# Altium schematic sheet USB Programmer.SchDoc
size A4; Organization: Machine Intellgence Laboratory; Des1: This is the MCU responsible; Des2: for programming the main MCU; Des3: from USB over UART.; SheetNumber: 2; SheetTotal: 5; Author1: Russell MacGregor; VersionControl_Repository: BatteryMonitorSpring2025
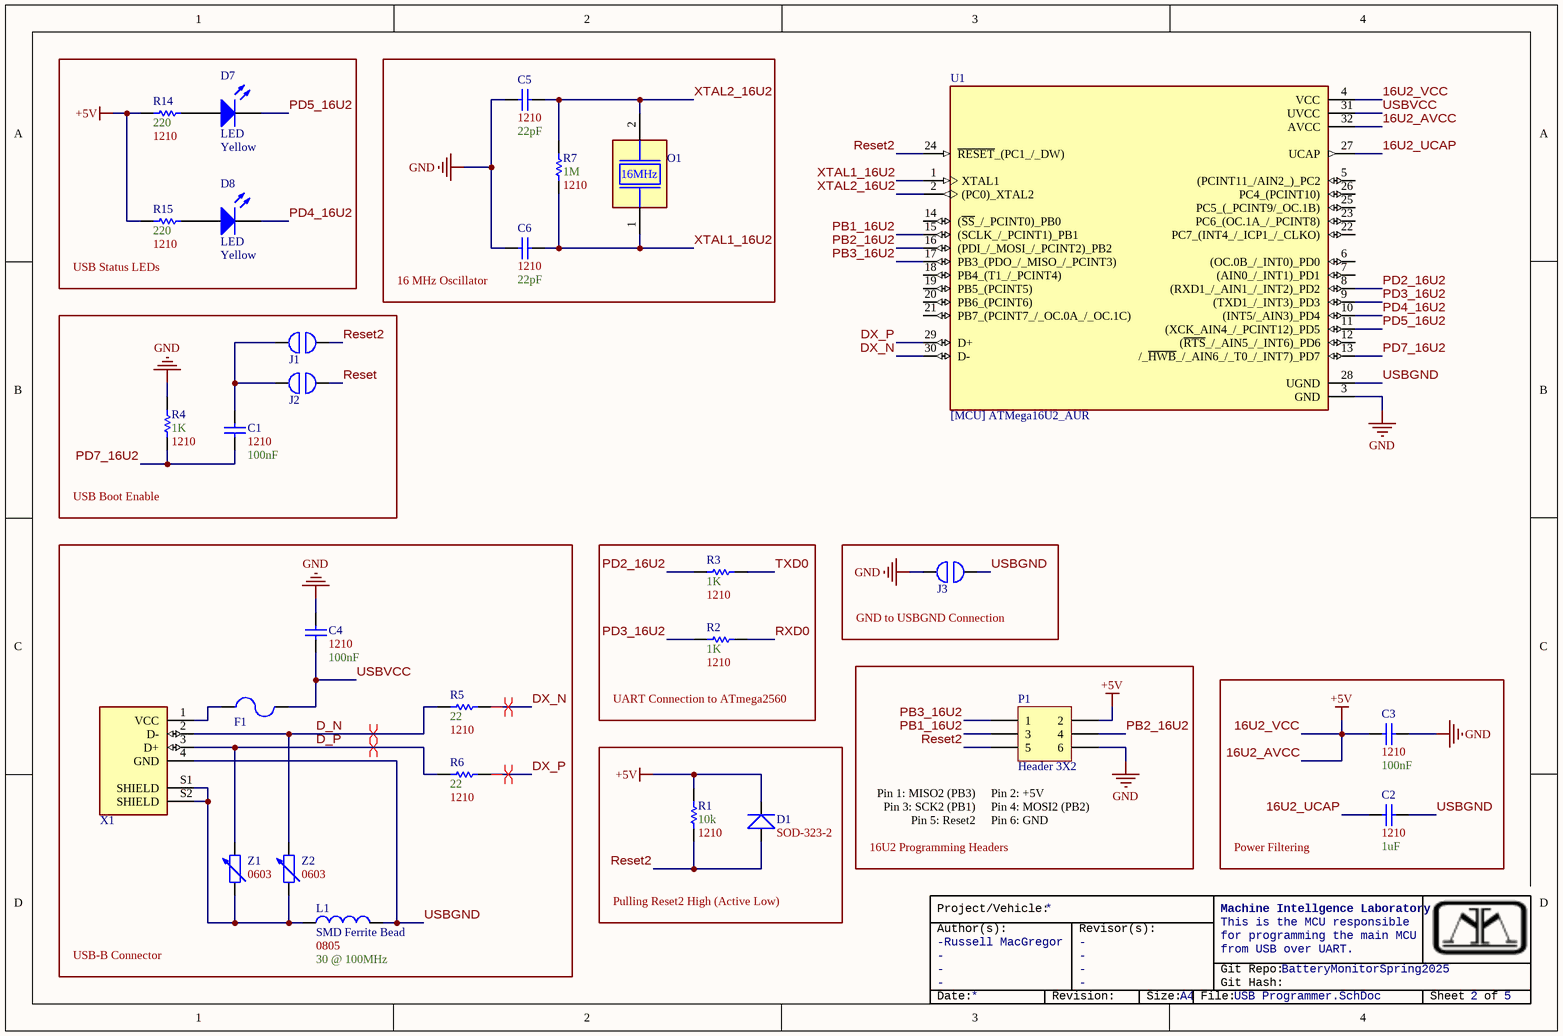
[diagram p0: USB Programmer.SchDoc]

## Parts
C1  Size Package: 1210  Capacitance: 100nF  [SMD Capacitor [1210]]  (hidden comment: SMD Cap - Nonpolarized)
C2  Size Package: 1210  Capacitance: 1uF  [SMD Capacitor [1210]]  (hidden comment: SMD Cap - Nonpolarized)
C3  Size Package: 1210  Capacitance: 100nF  [SMD Capacitor [1210]]  (hidden comment: SMD Cap - Nonpolarized)
C4  Size Package: 1210  Capacitance: 100nF  [SMD Capacitor [1210]]  (hidden comment: SMD Cap - Nonpolarized)
C5  Size Package: 1210  Capacitance: 22pF  [SMD Capacitor [1210]]  (hidden comment: SMD Cap - Nonpolarized)
C6  Size Package: 1210  Capacitance: 22pF  [SMD Capacitor [1210]]  (hidden comment: SMD Cap - Nonpolarized)
D1  Size Package: SOD-323-2  [SMD Diode [SOD-323-2]]  (hidden comment: SMD Diode)
D7  LED  Color: Yellow  [Small Yellow LED]
D8  LED  Color: Yellow  [Small Yellow LED]
F1  SMD 500mA Resetable Fuse  [SMD 500mA Resetable Fuse]  (value not drawn)
J1  Solderable Jumper  [Solderable Jumper]  (value not drawn)
J2  Solderable Jumper  [Solderable Jumper]  (value not drawn)
J3  Solderable Jumper  [Solderable Jumper]  (value not drawn)
L1  SMD Ferrite Bead  Size Package: 0805  Res @ Freq: 30 @ 100MHz  [SMD Ferrite Bead [0805]]
O1  Thru-Hole 16MHz Oscillator  [Thru-Hole 16MHz Oscillator]  (value not drawn)
P1  Header 3X2  [HDR2X3]
R1  Resistance: 10k  Size Package: 1210  [SMD Resistor [1210]]  (hidden comment: SMD Resistor)
R2  Resistance: 1K  Size Package: 1210  [SMD Resistor [1210]]  (hidden comment: SMD Resistor)
R3  Resistance: 1K  Size Package: 1210  [SMD Resistor [1210]]  (hidden comment: SMD Resistor)
R4  Resistance: 1K  Size Package: 1210  [SMD Resistor [1210]]  (hidden comment: SMD Resistor)
R5  Resistance: 22  Size Package: 1210  [SMD Resistor [1210]]  (hidden comment: SMD Resistor)
R6  Resistance: 22  Size Package: 1210  [SMD Resistor [1210]]  (hidden comment: SMD Resistor)
R7  Resistance: 1M  Size Package: 1210  [SMD Resistor [1210]]  (hidden comment: SMD Resistor)
R14  Resistance: 220  Size Package: 1210  [SMD Resistor [1210]]  (hidden comment: SMD Resistor)
R15  Resistance: 220  Size Package: 1210  [SMD Resistor [1210]]  (hidden comment: SMD Resistor)
U1  [MCU] ATMega16U2_AUR  [SMD ATMega16U2_AUR]
X1  USB Type-B Female (Thru-Hole)  [USB Type-B Female (Thru-Hole)]  (value not drawn)
Z1  Size Package: 0603  [SMD Varistor [0603]]  (hidden comment: SMD Varistor)
Z2  Size Package: 0603  [SMD Varistor [0603]]  (hidden comment: SMD Varistor)

## Blocks framed on the sheet
USB Status LEDs: D7 D8 R14 R15
16 MHz Oscillator: C5 C6 O1 R7
USB Boot Enable: C1 J1 J2 R4
USB-B Connector: C4 F1 L1 R5 R6 X1 Z1 Z2
UART Connection to ATmega2560: R2 R3
GND to USBGND Connection: J3
Power Filtering: C2 C3
Pulling Reset2 High (Active Low): D1 R1

## Nets
16U2_AVCC: C3.2 D1.C P1.2 R1.2 R14.2 R15.2 U1.4(VCC) U1.32(AVCC)  [also labelled +5V, 16U2_VCC]
GND: C3.1 C4.2 C5.2 C6.2 J3.1 P1.6 R4.2 U1.3(GND)
16U2_UCAP: C2.2 U1.27(UCAP)
D_N: R5.1 X1.2(D-) Z2.2
D_P: R6.1 X1.3(D+) Z1.2
DX_N: R5.2 U1.30(D-)
DX_P: R6.2 U1.29(D+)
PB1_16U2: P1.3 U1.15((SCLK_/_PCINT1)_PB1)
PB2_16U2: P1.4 U1.16((PDI_/_MOSI_/_PCINT2)_PB2)
PB3_16U2: P1.1 U1.17(PB3_(PDO_/_MISO_/_PCINT3))
PD2_16U2: R3.2 U1.8((RXD1_/_AIN1_/_INT2)_PD2)
PD3_16U2: R2.2 U1.9((TXD1_/_INT3)_PD3)
PD4_16U2: D8.2(K) U1.10((INT5/_AIN3)_PD4)
PD5_16U2: D7.2(K) U1.11((XCK_AIN4_/_PCINT12)_PD5)
PD7_16U2: C1.1 R4.1 U1.13(/_~{HWB}_/_AIN6_/_T0_/_INT7)_PD7)
Reset: J2.2
Reset2: D1.A J1.2 P1.5 R1.1 U1.24(~{RESET}_(PC1_/_DW))
RXD0: R2.1
TXD0: R3.1
USBGND: C2.1 J3.2 L1.2 U1.28(UGND) X1.4(GND)
USBVCC: C4.1 F1.2 U1.31(UVCC)
XTAL1_16U2: C6.1 O1.1 R7.1 U1.1(XTAL1)
XTAL2_16U2: C5.1 O1.2 R7.2 U1.2((PC0)_XTAL2)
NetC1_2: C1.2 J1.1 J2.1
NetD7_1: D7.1(A) R14.1
NetD8_1: D8.1(A) R15.1
NetF1_1: F1.1 X1.1(VCC)
NetL1_1: L1.1 X1.S1(SHIELD) X1.S2(SHIELD) Z1.1 Z2.1

Not connected (* = marked no-connect by the designer): U1 5((PCINT11_/AIN2_)_PC2) 6((OC.0B_/_INT0)_PD0) 7((AIN0_/_INT1)_PD1) 12((~{RTS}_/_AIN5_/_INT6)_PD6) 14((~{SS}_/_PCINT0)_PB0) 18(PB4_(T1_/_PCINT4)) 19(PB5_(PCINT5)) 20(PB6_(PCINT6)) 21(PB7_(PCINT7_/_OC.0A_/_OC.1C)) 22(PC7_(INT4_/_ICP1_/_CLKO)) 23(PC6_(OC.1A_/_PCINT8)) 25(PC5_(_PCINT9/_OC.1B)) 26(PC4_(PCINT10))

## Layout directives
differential pair: D_N, D_P, DX_N, DX_P

## Notes on the sheet
- 16U2 Programming Headers
- Pin 1: MISO2 (PB3)
- Pin 3: SCK2 (PB1)
- Pin 5: Reset2
- (near P1) Pin 2: +5V
- Pin 4: MOSI2 (PB2)
- Pin 6: GND
- Project/Vehicle:
- Author(s):
- -
- Revisor(s):
- Git Repo:
- Git Hash:
- Date:
- Revision:
- Size:
- A4
- File:
- Sheet
- of
- (in symbol Thru-Hole 16MHz Oscillator) 16MHz

## Library data of the parts
D1 = SMD Diode: Part #: CD1206-S01575 / JLC Part #: C75465; JLC Part #: C75465
D7 D8 = Small LED: 3mm LED
F1 = SMD 500mA Resetable Fuse: Part #: MF-MSMF050-2 / JLC Part #: C17313; JLC Part #: C17313; Size Package: 1812
L1 = SMD Ferrite Bead: JLC Part #: C840593 (default); JLC Part #: C840593
O1 = Thru-Hole 16MHz Oscillator: Part #: 2780-HC49US-FF3F18-16.000MHZ-ND (16MHz) / JLC Part #: C6873445; JLC Part #: C6873445
P1 = Header 3X2: Header, 3-Pin, Dual row; LatestRevisionDate: 17-Jul-2002; LatestRevisionNote: Re-released for DXP Platform.; Publisher: Altium Limited
R1 R7 R14 R15 = SMD Resistor: JLC Part #: C728401 / (for 1M Ohm Res)
  R1: Mouser Part #: 71-CRCW121010K0JNAIF
  R7: JLC Part #: C728401; Mouser Part #: 71-CRCW12101M00FKEAH
  R14 R15: Mouser Part #: 71-CRCW1210220RJNEAH
R2-R6 = SMD Resistor: JLC Part #:
  R2-R4: Mouser Part #: 71-CRCW12101K00JNAIF
  R5 R6: Mouser Part #: 71-CRCW121022R0JNEAH
U1 = [MCU] ATMega16U2_AUR: JLC Part #: C507117
X1 = USB Type-B Female (Thru-Hole): Part #: USB-B-S-F-B-TH / JLC Part #: C5714571 / OUT OF STOCK JLC; JLC Part #: C5714571
Z1 Z2 = SMD Varistor: JLC Part #: C840634 (for 0603 size); JLC Part #: C840634
C1-C6 = SMD Cap - Nonpolarized: JLC Part #: *
  C1 C3 C4: Mouser Part #: 581-12107C104KAT2A
  C2: Mouser Part #: 80-C1210X105K5RAUTO
  C5 C6: Mouser Part #: 77-VJ1210A220JXGAT5Z